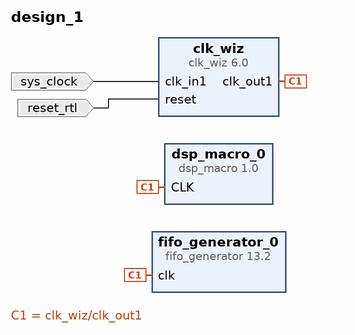
[diagram p0: block diagram of the top level]
# Vivado block design design_1, xc7z020clg484-1, Vivado 2020.2
create_bd_design design_1

create_bd_port -dir I -type clk sys_clock
set_property -dict {CONFIG.FREQ_HZ 100000000 CONFIG.PHASE 0.000} [get_bd_ports sys_clock]
create_bd_port -dir I -type rst reset_rtl
set_property -dict {CONFIG.POLARITY ACTIVE_HIGH} [get_bd_ports reset_rtl]

create_bd_cell -type ip -vlnv xilinx.com:ip:dsp_macro:1.0 dsp_macro_0
set_property -dict [list \
  CONFIG.a_binarywidth 0 \
  CONFIG.a_width 8 \
  CONFIG.areg_3 true \
  CONFIG.areg_4 true \
  CONFIG.b_binarywidth 0 \
  CONFIG.b_width 8 \
  CONFIG.breg_3 true \
  CONFIG.breg_4 true \
  CONFIG.c_binarywidth 0 \
  CONFIG.c_width 48 \
  CONFIG.concat_binarywidth 0 \
  CONFIG.concat_width 48 \
  CONFIG.creg_3 false \
  CONFIG.creg_4 false \
  CONFIG.creg_5 false \
  CONFIG.d_width 18 \
  CONFIG.instruction1 {P+A*B} \
  CONFIG.instruction2 {#} \
  CONFIG.mreg_5 true \
  CONFIG.p_full_width 48 \
  CONFIG.p_width 48 \
  CONFIG.pcin_binarywidth 0 \
  CONFIG.preg_6 true \
] [get_bd_cells dsp_macro_0]
create_bd_cell -type ip -vlnv xilinx.com:ip:clk_wiz:6.0 clk_wiz
set_property -dict {CONFIG.CLK_IN1_BOARD_INTERFACE sys_clock CONFIG.USE_BOARD_FLOW true} [get_bd_cells clk_wiz]
create_bd_cell -type ip -vlnv xilinx.com:ip:fifo_generator:13.2 fifo_generator_0

# ---- connections ----

connect_bd_net [get_bd_pins clk_wiz/clk_out1] [get_bd_pins dsp_macro_0/CLK] [get_bd_pins fifo_generator_0/clk]
connect_bd_net [get_bd_ports sys_clock] [get_bd_pins clk_wiz/clk_in1]
connect_bd_net [get_bd_ports reset_rtl] [get_bd_pins clk_wiz/reset]

validate_bd_design
save_bd_design
